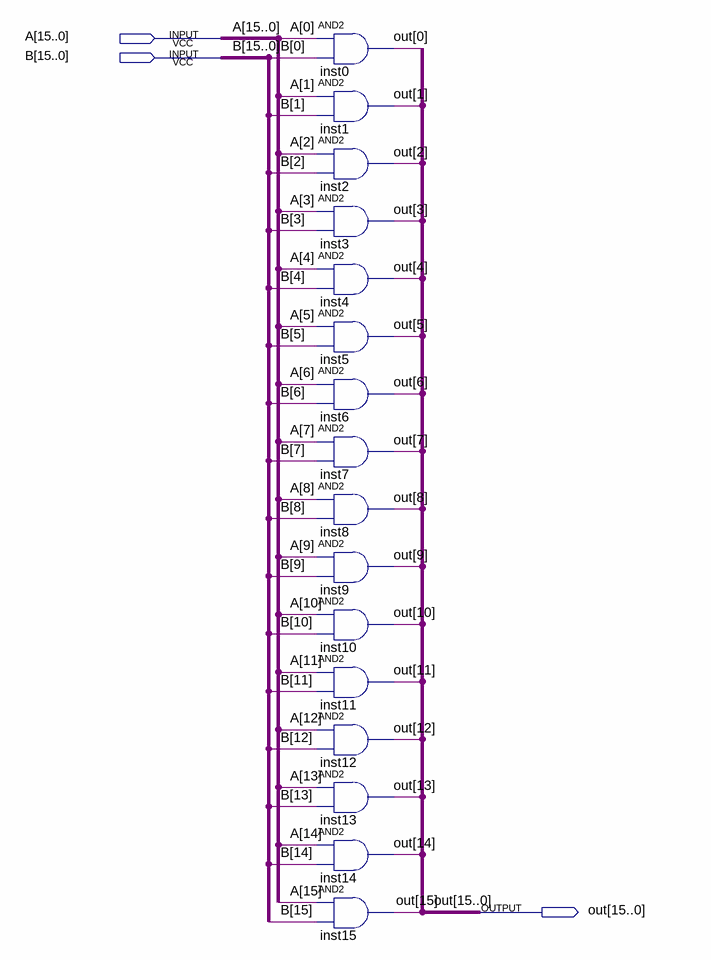
[diagram p0: schematic sheet]
// Quartus schematic 16bit_and.bdf as structural Verilog: 16 symbols, 3 pins
module \16bit_and  (
  input  [15:0] A,
  input  [15:0] B,
  output [15:0] out
);

  and inst0 (out[0], A[0], B[0]);
  and inst1 (out[1], A[1], B[1]);
  and inst2 (out[2], A[2], B[2]);
  and inst3 (out[3], A[3], B[3]);
  and inst4 (out[4], A[4], B[4]);
  and inst5 (out[5], A[5], B[5]);
  and inst6 (out[6], A[6], B[6]);
  and inst7 (out[7], A[7], B[7]);
  and inst8 (out[8], A[8], B[8]);
  and inst9 (out[9], A[9], B[9]);
  and inst10 (out[10], A[10], B[10]);
  and inst11 (out[11], A[11], B[11]);
  and inst12 (out[12], A[12], B[12]);
  and inst13 (out[13], A[13], B[13]);
  and inst14 (out[14], A[14], B[14]);
  and inst15 (out[15], A[15], B[15]);
endmodule
